# Altium schematic sheet Motor_Control.SchDoc
size A
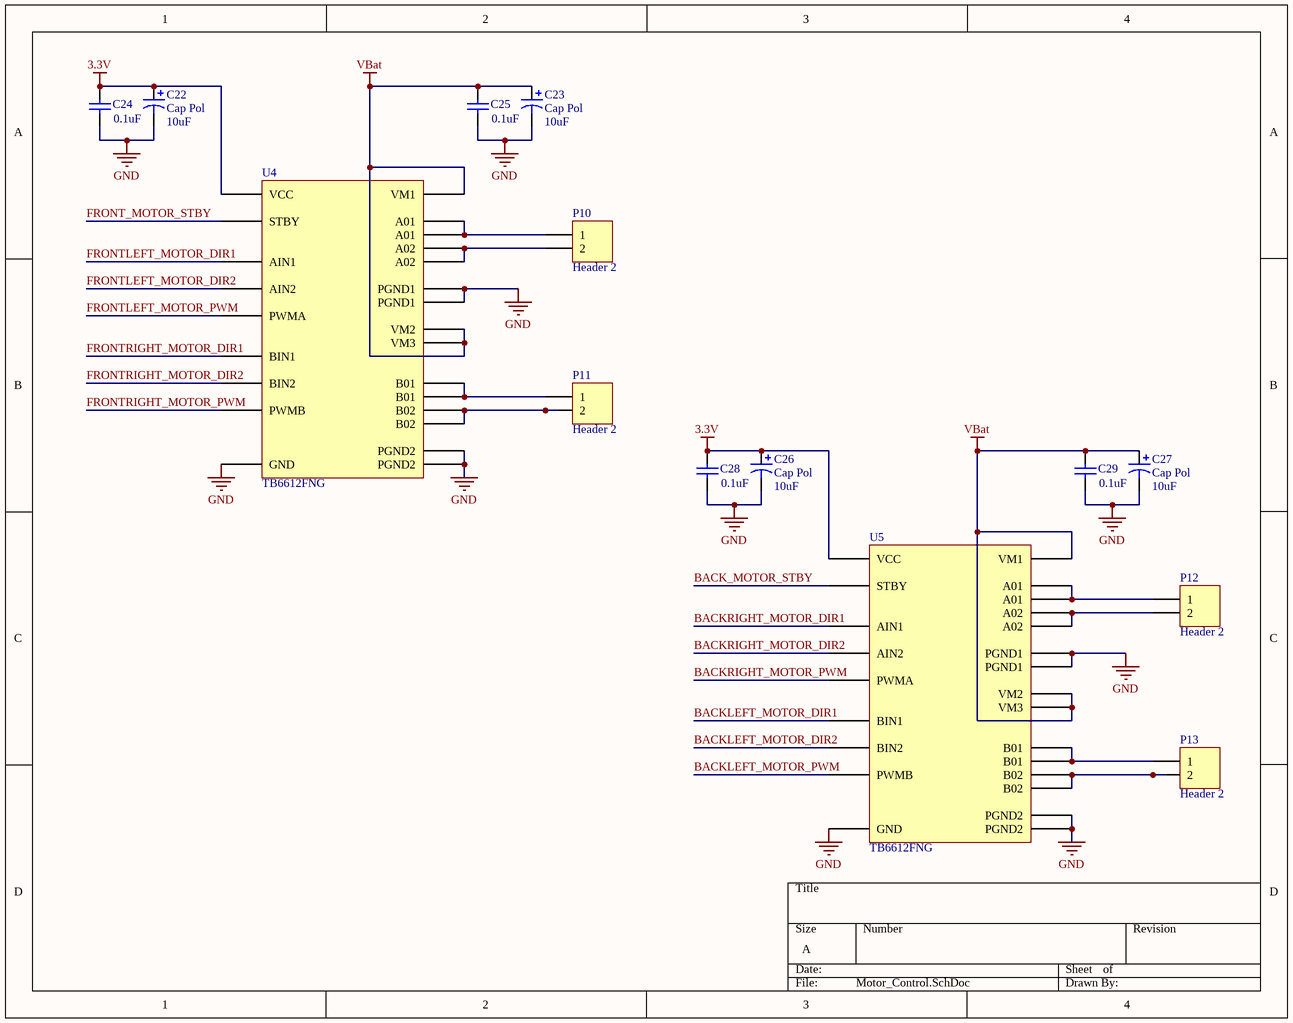
[diagram p0: Motor_Control.SchDoc]

## Parts
C22  Cap Pol  value 10uF  [1206]
C23  Cap Pol  value 10uF  [1206]
C24  value 0.1uF  [0805]  (hidden comment: Cap)
C25  value 0.1uF  [0805]  (hidden comment: Cap)
C26  Cap Pol  value 10uF  [1206]
C27  Cap Pol  value 10uF  [1206]
C28  value 0.1uF  [0805]  (hidden comment: Cap)
C29  value 0.1uF  [0805]  (hidden comment: Cap)
P10  Header 2  [HDR1X2]
P11  Header 2  [HDR1X2]
P12  Header 2  [HDR1X2]
P13  Header 2  [HDR1X2]
U4  TB6612FNG  [SSOP24-P-300-0.65A]
U5  TB6612FNG  [SSOP24-P-300-0.65A]

## Nets
3.3V: C22.1 C24.2 C26.1 C28.2 U4.20(VCC) U5.20(VCC)
GND: C22.2 C23.2 C24.1 C25.1 C26.2 C27.2 C28.1 C29.1 U4.3(PGND1) U4.4(PGND1) U4.9(PGND2) U4.10(PGND2) U4.18(GND) U5.3(PGND1) U5.4(PGND1) U5.9(PGND2) U5.10(PGND2) U5.18(GND)
VBat: C23.1 C25.2 C27.1 C29.2 U4.13(VM2) U4.14(VM3) U4.24(VM1) U5.13(VM2) U5.14(VM3) U5.24(VM1)
BACK_MOTOR_STBY: U5.19(STBY)
BACKLEFT_MOTOR_DIR1: U5.17(BIN1)
BACKLEFT_MOTOR_DIR2: U5.16(BIN2)
BACKLEFT_MOTOR_PWM: U5.15(PWMB)
BACKRIGHT_MOTOR_DIR1: U5.21(AIN1)
BACKRIGHT_MOTOR_DIR2: U5.22(AIN2)
BACKRIGHT_MOTOR_PWM: U5.23(PWMA)
FRONT_MOTOR_STBY: U4.19(STBY)
FRONTLEFT_MOTOR_DIR1: U4.21(AIN1)
FRONTLEFT_MOTOR_DIR2: U4.22(AIN2)
FRONTLEFT_MOTOR_PWM: U4.23(PWMA)
FRONTRIGHT_MOTOR_DIR1: U4.17(BIN1)
FRONTRIGHT_MOTOR_DIR2: U4.16(BIN2)
FRONTRIGHT_MOTOR_PWM: U4.15(PWMB)
NetP10_1: P10.1 U4.1(A01) U4.2(A01)
NetP10_2: P10.2 U4.5(A02) U4.6(A02)
NetP11_1: P11.1 U4.11(B01) U4.12(B01)
NetP11_2: P11.2 U4.7(B02) U4.8(B02)
NetP12_1: P12.1 U5.1(A01) U5.2(A01)
NetP12_2: P12.2 U5.5(A02) U5.6(A02)
NetP13_1: P13.1 U5.11(B01) U5.12(B01)
NetP13_2: P13.2 U5.7(B02) U5.8(B02)

## Library data of the parts
C22 C23 C26 C27 = Cap Pol: Polarized Capacitor
C24 C25 C28 C29 = Cap: Capacitor
P10-P13 = Header 2: Header, 2-Pin; LatestRevisionDate: 17-Jul-2002; LatestRevisionNote: Re-released for DXP Platform.; Publisher: Altium Limited
U4 U5 = TB6612FNG: Vendor Part No.: TB6612FNG(OC8EL)CT-ND; Manufacturer: Toshiba; Vendor: Digikey; Manufacturer Part No: TB6612FNG